# EAGLE design DCC-light (EAGLE 7.4.0)
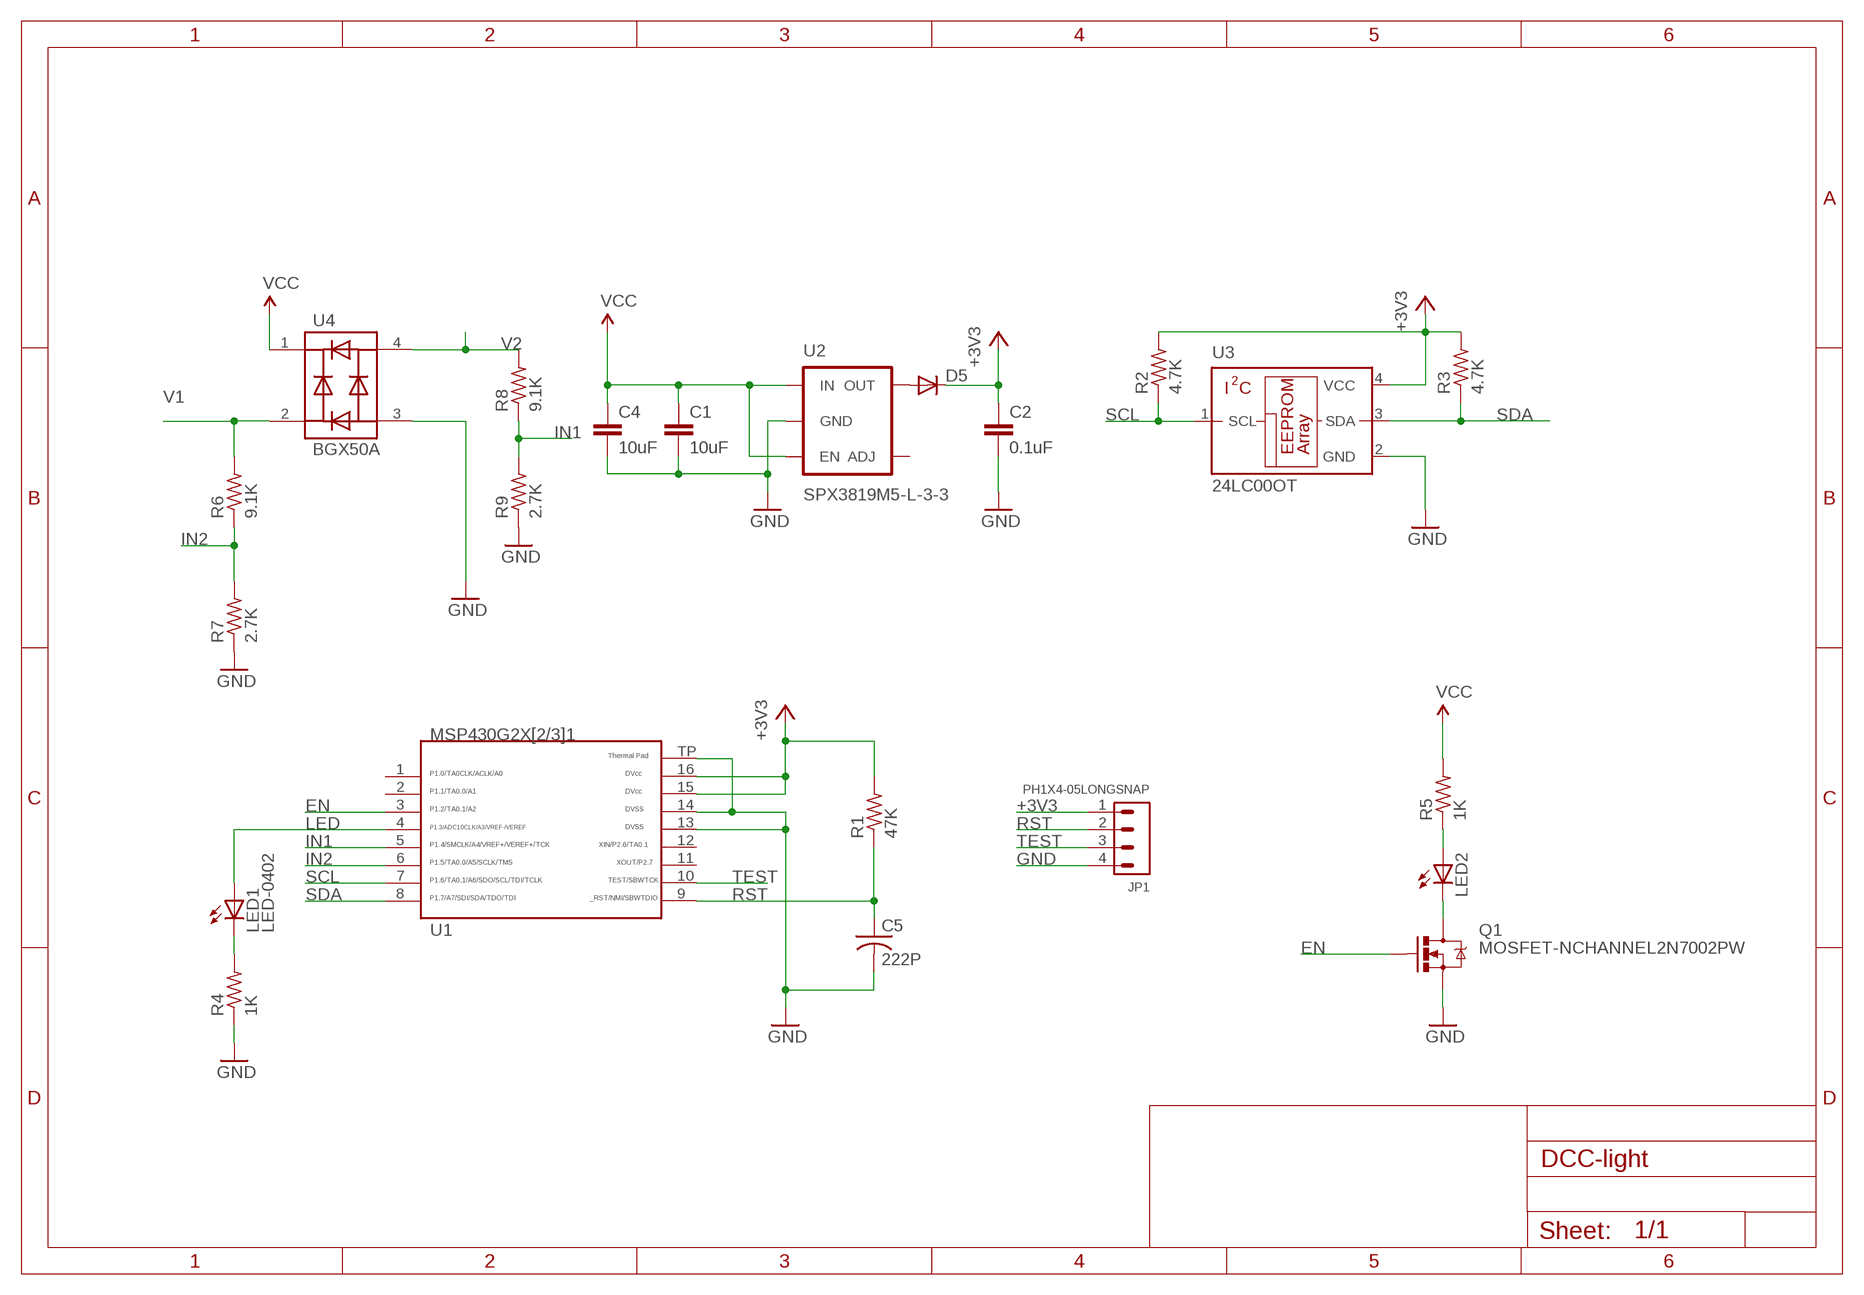
[diagram p0: schematic, sheet 1]

## Parts
C1  10uF  CAP0402-CAP  [0402-CAP]
C2  0.1uF  CAP0603-CAP  [0603-CAP]
C4  10uF  CAP0603-CAP  [0603-CAP]
C5  222P  C-USC0402  [C0402]
D5  DIODE-SOD523  [SOD523]
JP1  PH1X4-05LONGSNAP  [PHLS005-1-4]
LED1  LED-0402  [0402-LED]
LED2  LEDSMT1206  [1206]
Q1  MOSFET-NCHANNEL2N7002PW  [SOT323]
R1  47K  R-US_R0402  [R0402]
R2  4.7K  R-US_R0402  [R0402]
R3  4.7K  R-US_R0402  [R0402]
R4  1K  R-US_R0402  [R0402]
R5  1K  R-US_R0603  [R0603]
R6  9.1K  R-US_R0402  [R0402]
R7  2.7K  R-US_R0402  [R0402]
R8  9.1K  R-US_R0402  [R0402]
R9  2.7K  R-US_R0402  [R0402]
U1  G2X[2/3]1---RSA16  [RSA16]
U2  SPX3819M5-L-3-3  AP2202-ADJ  [SOT23-5]
U3  24LC00OT  [SOT23-5L]
U4  BGX50A  [SOT143]

## Nets
+3V3: C2.1 D5.C JP1.1 R1.2 R2.2 R3.2 U1.15 U1.16 U3.4(VCC)
EN: Q1.1(G) U1.3
GND: C1.2 C2.2 C4.2 C5.2 JP1.4 Q1.2(S) R4.1 R7.1 R9.1 U1.13 U1.14 U1.TP U2.2(GND) U3.2(GND) U4.3
IN1: R8.1 R9.2 U1.5
IN2: R6.1 R7.2 U1.6
LED: LED1.A U1.4
N$1: LED2.C Q1.3(D)
N$2: LED2.A R5.1
N$3: LED1.C R4.2
N$5: D5.A U2.5(OUT)
RST: C5.1 JP1.2 R1.1 U1.9
SCL: R2.1 U1.7 U3.1(SCL)
SDA: R3.1 U1.8 U3.3(SDA)
TEST: JP1.3 U1.10
V1: R6.2 U4.2
V2: R8.2 U4.4
VCC: C1.1 C4.1 R5.2 U2.1(IN) U2.3(EN) U4.1
Unconnected: U1.1 U1.2 U1.11 U1.12 U2.4(ADJ)

## Library data of the parts
C1 C2 C4 = SparkFun-Passives:CAP: Capacitor Standard 0603 ceramic capacitor, and 0.1" leaded capacitor.
C5 = adafruit:C-US: CAPACITOR, American symbol
D5 = RoboJackets-Diodes:DIODE-: DIODE
JP1 = pel_hdr:PH1X4
LED1 = pel_dipol_comp:LED
LED2 = RepRapjr:LED: LED OSRAM: - CHIPLED LG R971, LG N971, LY N971, LG Q971, LY Q971, LO R971, LY R971 LH N974, LH R974 LS Q976, LO Q976, LY Q976 LO Q996 - Hyper CHIPLED LW Q18S LB Q993, LB Q99A, LB R99A - SideLED LS A670, LO A670, LY A670, LG A670, LP A670 LB A673, LV A673, LT A673, LW A673 LH A674 LY A675 LS A676, LA A676, LO A676, LY A676, LW A676 LS A679, LY A679, LG A679 - Hyper Micro SIDELED® LS Y876, LA Y876, LO Y876, LY Y876 LT Y87S - SmartLED LW L88C, LW L88S LB L89C, LB L89S, LG L890 LS L89K, LO L89K, LY L89K LS L896, LA L896, LO L896, LY L896 - TOPLED LS T670, LO T670, LY T670, LG T670, LP T670 LSG T670, LSP T670, LSY T670, LOP T670, LYG T670 LG T671, LOG T671, LSG T671 LB T673, LV T673, LT T673, LW T673 LH T674 LS T676, LA T676, LO T676, LY T676, LB T676, LH T676, LSB T676, LW T676 LB T67C, LV T67C, LT T67C, LS T67K, LO T67K, LY T67K, LW E67C LS E67B, LA E67B, LO E67B, LY E67B, LB E67C, LV E67C, LT E67C LW T67C LS T679, LY T679, LG T679 LS T770, LO T770, LY T770, LG T770, LP T770 LB T773, LV T773, LT T773, LW T773 LH T774 LS E675, LA E675, LY E675, LS T675 LS T776, LA T776, LO T776, LY T776, LB T776 LHGB T686 LT T68C, LB T68C - Hyper Mini TOPLED® LB M676 - Mini TOPLED Santana® LG M470 LS M47K, LO M47K, LY M47K Source: http://www.osram.convergy.de LUXEON: - LUMILED® LXK2-PW12-R00, LXK2-PW12-S00, LXK2-PW14-U00, LXK2-PW14-V00 LXK2-PM12-R00, LXK2-PM12-S00, LXK2-PM14-U00 LXK2-PE12-Q00, LXK2-PE12-R00, LXK2-PE12-S00, LXK2-PE14-T00, LXK2-PE14-U00 LXK2-PB12-K00, LXK2-PB12-L00, LXK2-PB12-M00, LXK2-PB14-N00, LXK2-PB14-P00, LXK2-PB14-Q00 LXK2-PR12-L00, LXK2-PR12-M00, LXK2-PR14-Q00, LXK2-PR14-R00 LXK2-PD12-Q00, LXK2-PD12-R00, LXK2-PD12-S00 LXK2-PH12-R00, LXK2-PH12-S00 LXK2-PL12-P00, LXK2-PL12-Q00, LXK2-PL12-R00 Source: www.luxeon.com KINGBRIGHT: KA-3528ASYC Source: www.kingbright.com
Q1 = SparkFun-DiscreteSemi:MOSFET-NCHANNEL: Common NMOSFET Parts MFG P/N Store ID Prod ID FDD8780 TRANS-09984 SI7820DN TRANS-11055 FDS6630A IC-08089 2N7002PW TRANS-11151 FQP30N06L COM-10213 TRANS-10060 BSS123LT1G TRANS-08345 BSS138 TRANS-00830 BS170 2N7000; PROD_ID: TRANS-11151
R1-R9 = adafruit:R-US_: RESISTOR, American symbol
U1 = TI_MSP430_v16:G2X[2/3]1---RSA16: MSP430G2X[2/3]1 QFN (RSA) 16 Pin Package http://focus.ti.com/docs/prod/folders/print/msp430g2221.html
U2 = SparkFun-PowerIC:AP2202-ADJ: AP2202 Adjustable LDO Diodes Inc small, low-cost LDO 150mA, 13.2V, less than 200mV dropout; PROD_ID: VREG-12189; VALUE: AP2202-ADJ
U3 = microchip:24*00: Serial EEPROM 128 bit, I2C (AA = 1.8 V/LC = 2.5 V/C = 5.0 V); MF: MICROCHIP; MPN: 24LC00T-I/OT; OC_FARNELL: 9757864; OC_NEWARK: 62K0574
U4 = semicon-smd-ipc:BGX50A

## Board
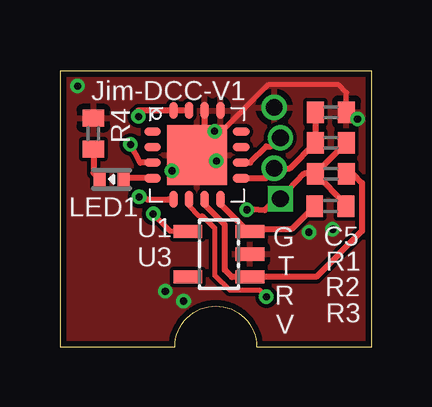
[diagram p1: board, top side]
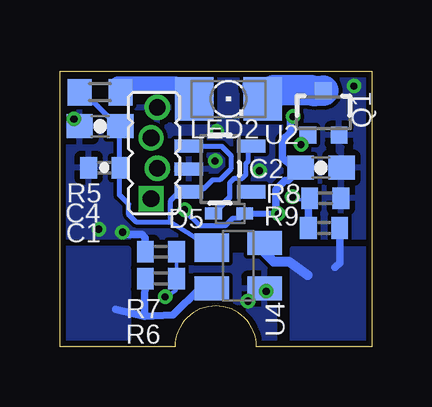
[diagram p2: board, bottom side, seen from below]

Size 13 x 11.5 mm. Coordinates in mm from the lower left corner, seen from the top.
Outline: 0,0 4.8,0 arc-180 8.2,0 13,0 13,11.5 0,11.5 0,0
Copper layers (1*16): Top 0.035mm / dielectric 1.5mm / Bottom 0.035mm
Design rules "6mil": minimum track width 6mil, minimum drill 6mil, track to track 6mil, track to pad 6mil, pad to pad 6mil, via to via 6mil, smd to smd 6mil, copper to edge 10mil, drill to drill 8mil, minimum pad ring 6mil, minimum via ring 6mil, stop-mask expansion 4mil, vias tented up to drill 15mil, thermal gap 10mil

### Footprints (pad centres in the part's own frame; a part is rotated, then mirrored left to right if it is on the bottom)
0402-CAP = smd 0.7 x 0.9: 1 -0.65,0; 2 0.65,0
0603-CAP = smd 1.1 x 1: 1 -0.85,0; 2 0.85,0
C0402 = smd 0.7 x 0.9: 1 -0.65,0; 2 0.65,0
SOD523 = smd 0.7 x 0.5: A 0.7,0; C -0.6,0
PHLS005-1-4 = drill 0.7 pad 1.016 square: 1 0,0.127 | drill 0.7 pad 1.016: 2 1.27,-0.127; 3 2.54,0.127; 4 3.81,-0.127
0402-LED = smd 0.5 x 0.6: A 0.5,0; C -0.5,0
1206 = smd 1.6 x 1.803: A -1.422,0; C 1.422,0
SOT323 = smd 0.7 x 0.7: 1 -0.65,-0.925; 2 0.65,-0.925; 3 0,0.925
R0402 = smd 0.7 x 0.9: 1 -0.65,0; 2 0.65,0
R0603 = smd 1 x 1.1: 1 -0.85,0; 2 0.85,0
RSA16 = smd 0.7 x 0.35: 1 -1.85,0.975; 2 -1.85,0.325; 3 -1.85,-0.325; 4 -1.85,-0.975; 9 1.85,-0.975; 10 1.85,-0.325; 11 1.85,0.325; 12 1.85,0.975 | smd 0.35 x 0.7: 5 -0.975,-1.85; 6 -0.325,-1.85; 7 0.325,-1.85; 8 0.975,-1.85; 13 0.975,1.85; 14 0.325,1.85; 15 -0.325,1.85; 16 -0.975,1.85 | smd 2.5 x 2.5: TP 0,0
SOT23-5 = smd 0.55 x 1.2: 1 -0.95,-1.3; 2 0,-1.3; 3 0.95,-1.3; 4 0.95,1.3; 5 -0.95,1.3
SOT23-5L = smd 0.55 x 1.2: 1 -0.95,-1.3; 2 0,-1.3; 3 0.95,-1.3; 4 0.95,1.3; 5 -0.95,1.3
SOT143 = smd 1.2 x 1.44: 1 -0.75,-1.1 | smd 1 x 1.44: 2 0.95,-1.1; 3 0.95,1.1; 4 -0.95,1.1

### Placement (x,y rotation side)
C1  11.15,7.47 180 bottom
C2  2.11,7.47 0 bottom
C4  11.33,9.19 180 bottom
C5  11.3,9.78 0 top
D5  5.89,5.56 180 bottom
JP1  9.07,6.17 90 bottom
LED1  2.16,6.99 0 top
LED2  5.97,10.34 0 bottom
Q1  2.01,9.75 0 bottom
R1  11.3,8.51 0 top
R2  11.3,7.21 180 top
R3  11.28,5.87 0 top
R4  1.4,8.89 270 top
R5  11.33,10.62 180 bottom
R6  8.79,2.84 180 bottom
R7  8.79,3.96 0 bottom
R8  1.98,4.95 0 bottom
R9  1.93,6.2 180 bottom
U1  5.71,8 0 top
U2  6.32,7.42 270 bottom
U3  6.63,3.86 90 top
U4  5.56,3.38 270 bottom

### Tracks (layer width: path | path; a pad name or v marks a point on that pad's centre or on a via)
+3V3  (via drill 0.3)
  Top 0.203: U3.4 4.61,4.81 v3.89,5.54
  Top 0.254: R3.2 11.93,5.94 R2.2 | R1.2 R2.2 | R2.2 10.19,7.21 JP1.1 9.02,6.17 8.53,5.69 7.82,5.74 v7.8,5.71 | U1.16 U1.15 3.27,9.85 v3.28,9.6
  Bottom 0.203: v7.8,5.71 7.8,5.69 7.16,5.05 6.1,5.05 5.79,5.36 5.5,5.36 D5.C
  Bottom 0.254: D5.C 3.91,5.56 v3.89,5.54
  Bottom 0.305: v3.89,5.54 3.89,5.69 3.99,5.79 3.99,6.55 3.61,6.93 3.49,6.93 C2.1 3.28,7.47 3.71,7.9 3.71,8.61 3.38,8.94 3.38,9.5 v3.28,9.6
EN  (via drill 0.3)
  Top 0.254: U1.3 3.35,7.68 v2.95,8.43
  Bottom 0.254: v2.95,8.43 2.92,8.41 Q1.1
GND  (via drill 0.3)
  Top 0.203: U1.TP 5.33,8 v4.67,7.34 | 5.66,8.03 6.66,9.02 6.78,9.02 8.69,10.92 11.63,10.92 11.95,10.6 C5.2 12.33,9.4 v12.42,9.5
  Top 0.254: U1.14 6.04,8.61 | v6.53,7.75 5.92,8 U1.TP 6.04,8.33 6.04,8.61 | 6.04,8.61 v6.45,8.99
  Bottom 0.203: C4.2 12.5,9.2 v12.42,9.5
  Bottom 0.305: R7.1 9.44,4.54 9.58,4.67 10.29,4.67 v10.39,4.78
  other vias: 0.74,10.87 4.39,2.31 11.38,4.9 5.16,1.91
  pour Bottom: 0.13,11.43 12.95,11.43 12.95,4.57 0.13,4.57
  pour Top: 0.13,11.43 12.95,11.43 12.95,0.13 0,0.13
  pour Bottom: 4.06,0.25 8.64,0.25 8.64,3.81 4.06,3.81
IN1  (via drill 0.3)
  Top 0.152: 3.63,6.15 3.4,6.15 v3.3,6.25
  Top 0.203: U1.5 4.5,6.15
  Top 0.254: 3.63,6.15 4.71,6.15 U1.5
  Bottom 0.152: 2.63,6.15 3.2,6.15 v3.3,6.25
  Bottom 0.305: R8.1 2.63,6.15 R9.2
IN2  (via drill 0.3)
  Top 0.203: U1.6 5.39,5.86 5.79,5.46 5.94,5.46 6.45,4.95 6.45,2.97 6.48,2.97 7.09,2.36 8.33,2.36 v8.61,2.08
  Bottom 0.152: v8.61,2.08 8.16,2.35 R6.1 R7.2
LED
  Top 0.254: U1.4 2.7,7.03 LED1.A
N$1
  Bottom 0.254: Q1.3 2.19,10.32 | 4.22,10.67 LED2.C
  Bottom 0.406: 2.38,10.67 2.54,10.69 | 4.06,10.69 4.55,10.67 LED2.C
  Bottom 0.813: 5,10.82 5,10.79 LED2.C
  Bottom 1.27: 2.38,10.67 Q1.3 | 2.54,10.69 4.06,10.69
N$2
  Bottom 0.254: R5.1 10.56,10.65
  Bottom 0.61: LED2.A 7.54,10.34 8.18,10.97 10.6,10.97 R5.1
N$3
  Top 0.254: R4.2 1.4,7.25 LED1.C
N$5
  Bottom 0.203: 5.15,8.37 5.15,7.73 5.26,7.62 5.26,7.16 5.41,7.01 5.74,7.01 5.92,6.83 5.92,6.24 5.94,6.21
  Bottom 0.254: U2.5 5.15,8.37 | 5.94,6.21 D5.A
RST
  Top 0.254: C5.1 R1.1 9.59,7.44 JP1.2 8.57,7.03 U1.9
SCL
  Top 0.254: U1.7 6.04,5.92 6.88,5.08 6.88,3.2 7.17,2.91 U3.1 7.94,2.92 10.69,2.92 12.6,4.83 12.6,6.83 12.22,7.21 R2.1
SDA
  Top 0.254: U3.3 7.93,4.91 | 7.93,4.91 9.67,4.91 R3.1 | 7.93,4.91 7.74,4.91 6.69,5.96 U1.8
TEST
  Top 0.254: U1.10 7.93,7.68 8.61,8.36 8.79,8.36 JP1.3
V1
  Bottom 0.305: U4.2 7.15,2.43 8.28,1.32 9.47,1.27 | 9.47,1.27 10.67,1.55 | R6.2 9.46,1.74 9.47,1.27
  pour Bottom: 12.95,4.09 10.16,4.09 10.16,0.25 12.95,0.25
V2
  Bottom 0.305: R8.2 1.33,3.5 1.52,3.3
  Bottom 0.406: U4.4 4.91,4.38 4.09,3.56 3.45,3.56 2.67,2.99
  pour Bottom: 0.25,4.06 3.3,4.06 3.3,0.25 0.25,0.25
VCC
  Bottom 0.203: 8.38,5.21 9.83,5.21 10.13,5.51 10.13,5.94 10.52,6.33 10.52,7.45 C1.1 10.5,9.17 C4.1 10.59,9.2 11.56,10.16 11.72,10.16 R5.2 | 8.38,5.21 U4.1 | U2.1 6.26,8.37 5.87,7.98 5.87,7.42 6.33,6.96 6.63,6.96 7.01,6.58 7.51,6.58 U2.3 7.74,6.35 8.13,6.35 8.38,6.1 8.38,5.21

### Text on the board
tPlace: Jim-DCC-V1 | G / T / R / V